# EAGLE design Ocreeb 12 (EAGLE 9.6.2)
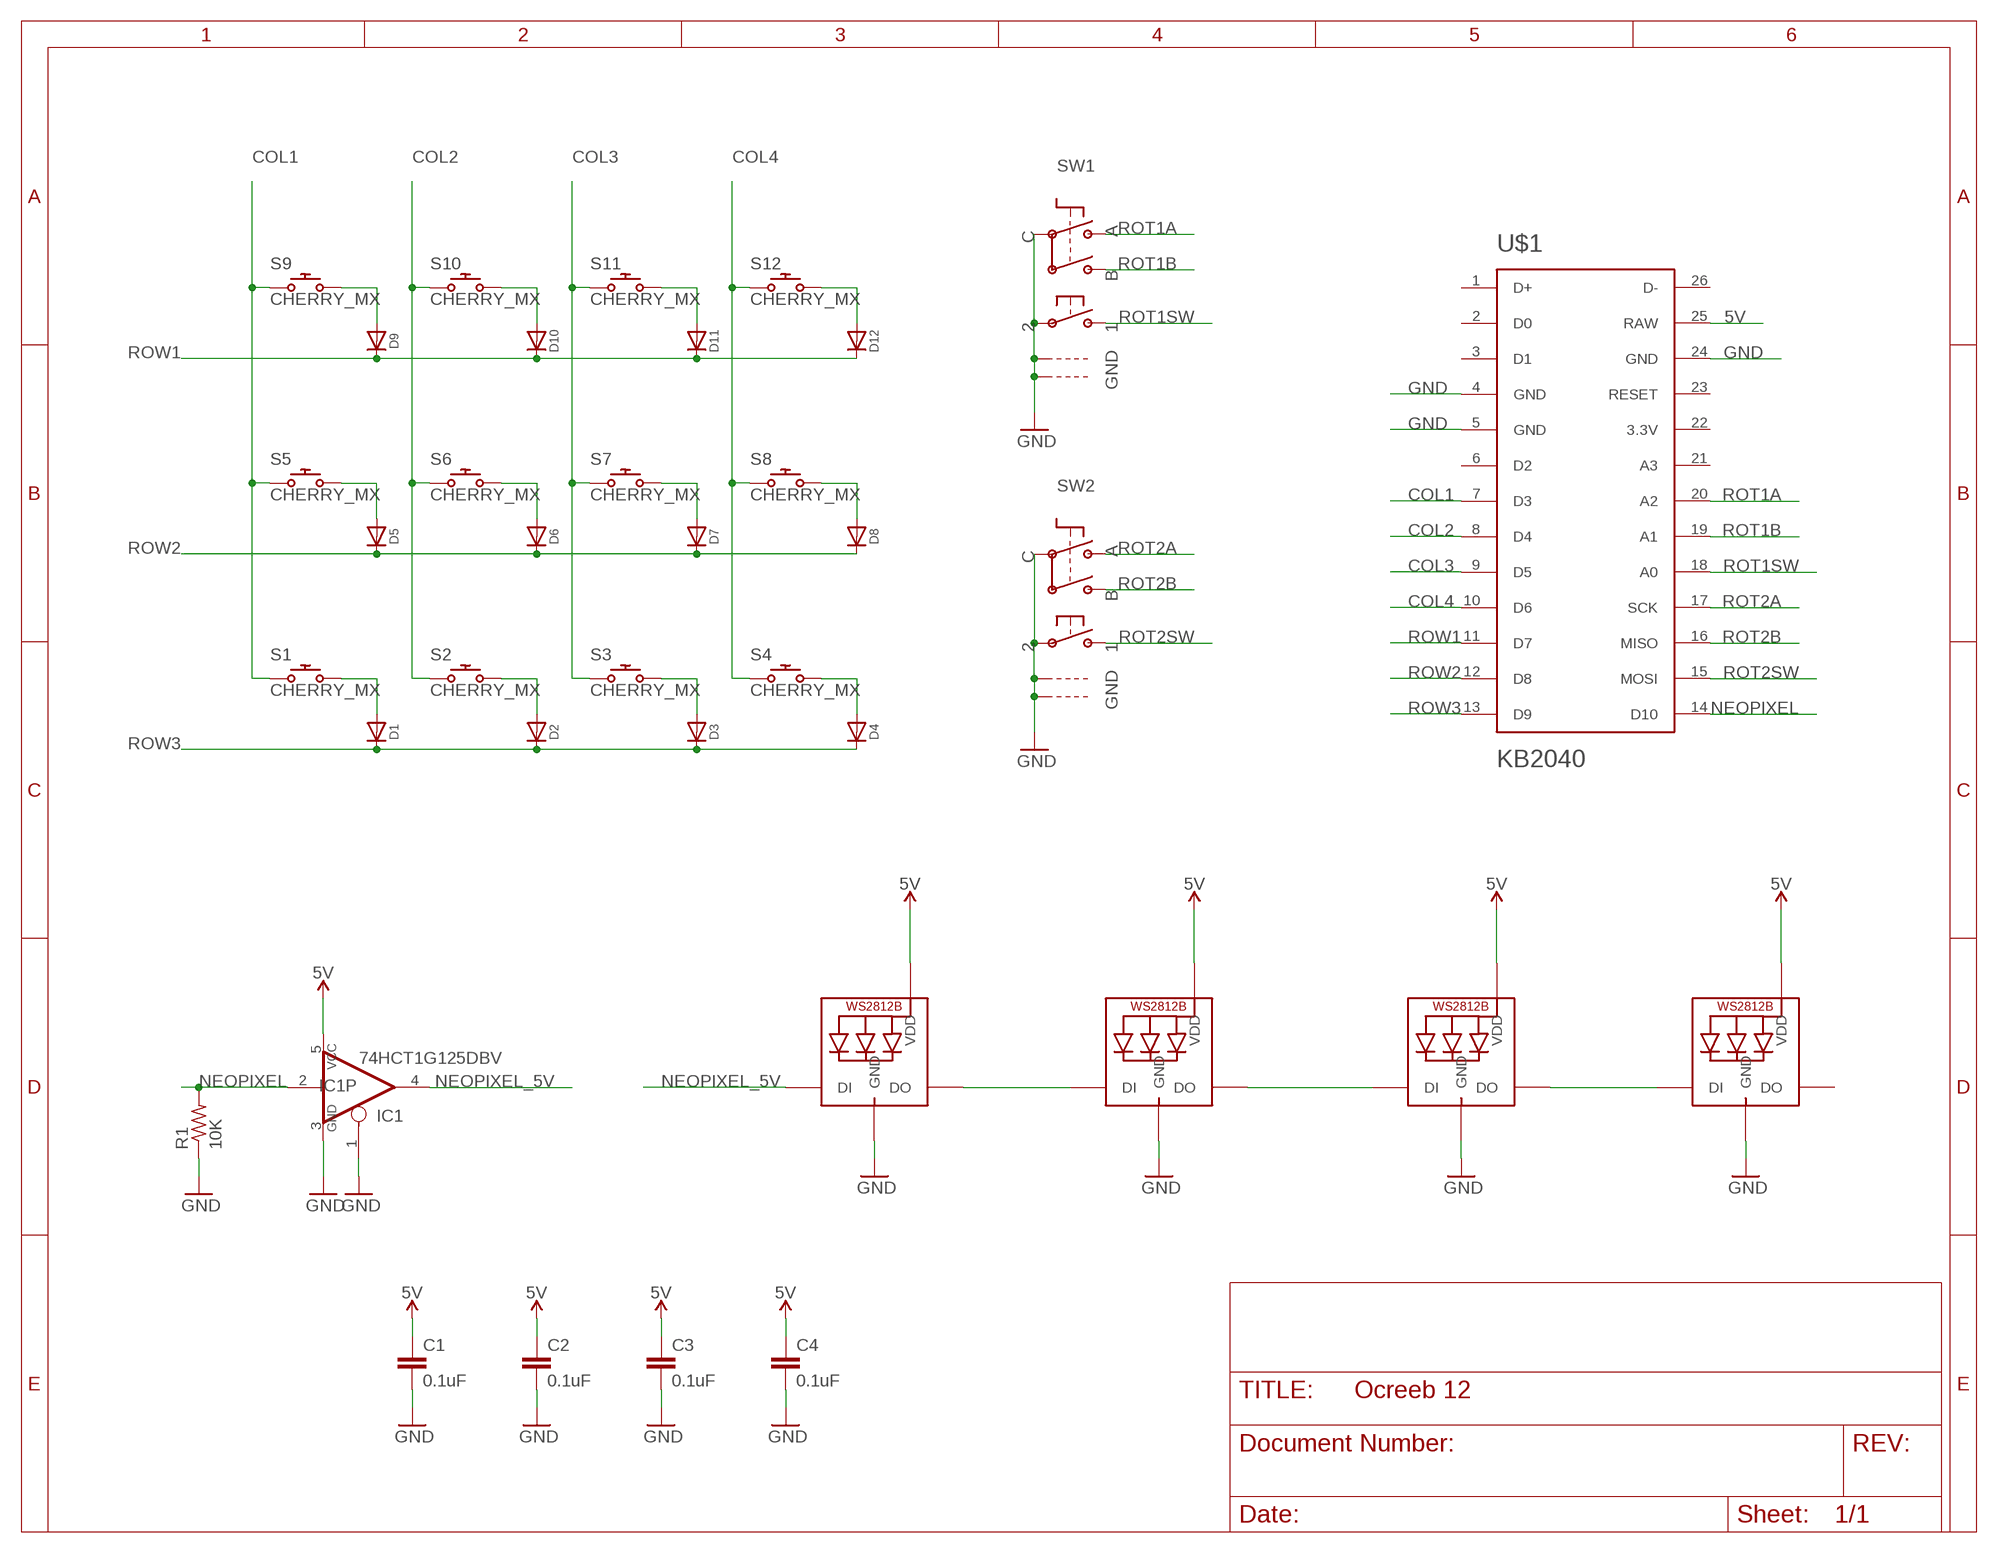
[diagram p0: schematic, sheet 1]

## Parts
C1  0.1uF  0.1UF-0603-25V-(+80/-20%)  [0603]
C2  0.1uF  0.1UF-0603-25V-(+80/-20%)  [0603]
C3  0.1uF  0.1UF-0603-25V-(+80/-20%)  [0603]
C4  0.1uF  0.1UF-0603-25V-(+80/-20%)  [0603]
D1  MICROBUILDER_DIODESOD-123  [MICROBUILDER_SOD-123]
D2  MICROBUILDER_DIODESOD-123  [MICROBUILDER_SOD-123]
D3  MICROBUILDER_DIODESOD-123  [MICROBUILDER_SOD-123]
D4  MICROBUILDER_DIODESOD-123  [MICROBUILDER_SOD-123]
D5  MICROBUILDER_DIODESOD-123  [MICROBUILDER_SOD-123]
D6  MICROBUILDER_DIODESOD-123  [MICROBUILDER_SOD-123]
D7  MICROBUILDER_DIODESOD-123  [MICROBUILDER_SOD-123]
D8  MICROBUILDER_DIODESOD-123  [MICROBUILDER_SOD-123]
D9  MICROBUILDER_DIODESOD-123  [MICROBUILDER_SOD-123]
D10  MICROBUILDER_DIODESOD-123  [MICROBUILDER_SOD-123]
D11  MICROBUILDER_DIODESOD-123  [MICROBUILDER_SOD-123]
D12  MICROBUILDER_DIODESOD-123  [MICROBUILDER_SOD-123]
IC1  74HCT1G125DBV  74AHC1G125DBV  [SOT23-5]
LED1  WS2812B5050  [WS2812B]
LED2  WS2812B5050  [WS2812B]
LED3  WS2812B5050  [WS2812B]
LED4  WS2812B5050  [WS2812B]
R1  10K  R-US_R0805  [R0805]
S1  CHERRY_MX  [CHERRY_MX]
S2  CHERRY_MX  [CHERRY_MX]
S3  CHERRY_MX  [CHERRY_MX]
S4  CHERRY_MX  [CHERRY_MX]
S5  CHERRY_MX  [CHERRY_MX]
S6  CHERRY_MX  [CHERRY_MX]
S7  CHERRY_MX  [CHERRY_MX]
S8  CHERRY_MX  [CHERRY_MX]
S9  CHERRY_MX  [CHERRY_MX]
S10  CHERRY_MX  [CHERRY_MX]
S11  CHERRY_MX  [CHERRY_MX]
S12  CHERRY_MX  [CHERRY_MX]
SW1  ADAFRUIT_ELECTROMECH_ENCODER_PLUS_SWITCH_BOURNS_PEC11  [ADAFRUIT_ELECTROMECH_PEC11+SWITCH]
SW2  ADAFRUIT_ELECTROMECH_ENCODER_PLUS_SWITCH_BOURNS_PEC11  [ADAFRUIT_ELECTROMECH_PEC11+SWITCH]
U$1  KB2040  [KB2040_SMD]

## Nets
5V [5V]: C1.1 C2.1 C3.1 C4.1 IC1.5(VCC) LED1.1-VDD(VDD) LED2.1-VDD(VDD) LED3.1-VDD(VDD) LED4.1-VDD(VDD) U$1.25(RAW)
COL1: S1.S1 S5.S1 S9.S1 U$1.7(D3)
COL2: S2.S1 S6.S1 S10.S1 U$1.8(D4)
COL3: S3.S1 S7.S1 S11.S1 U$1.9(D5)
COL4: S4.S1 S8.S1 S12.S1 U$1.10(D6)
GND: C1.2 C2.2 C3.2 C4.2 IC1.1(OE) IC1.3(GND) LED1.3-GND(GND) LED2.3-GND(GND) LED3.3-GND(GND) LED4.3-GND(GND) R1.1 SW1.P$2 SW1.P$C SW1.P$GND1 SW1.P$GND2 SW2.P$2 SW2.P$C SW2.P$GND1 SW2.P$GND2 U$1.4(GND) U$1.5(GND) U$1.24(GND)
N$1: LED1.2-DOUT(DO) LED2.4-DIN(DI)
N$2: LED2.2-DOUT(DO) LED3.4-DIN(DI)
N$3: LED3.2-DOUT(DO) LED4.4-DIN(DI)
N$5: D5.A S5.S2
N$14: D6.A S6.S2
N$15: D8.A S8.S2
N$16: D7.A S7.S2
N$18: D2.A S2.S2
N$19: D3.A S3.S2
N$20: D1.A S1.S2
N$21: D4.A S4.S2
N$22: D10.A S10.S2
N$23: D12.A S12.S2
N$24: D11.A S11.S2
N$25: D9.A S9.S2
NEOPIXEL: IC1.2(I) R1.2 U$1.14(D10)
NEOPIXEL_5V: IC1.4(O) LED1.4-DIN(DI)
ROT1A: SW1.P$A U$1.20(A2)
ROT1B: SW1.P$B U$1.19(A1)
ROT1SW: SW1.P$1 U$1.18(A0)
ROT2A: SW2.P$A U$1.17(SCK)
ROT2B: SW2.P$B U$1.16(MISO)
ROT2SW: SW2.P$1 U$1.15(MOSI)
ROW1: D9.C D10.C D11.C D12.C U$1.11(D7)
ROW2: D5.C D6.C D7.C D8.C U$1.12(D8)
ROW3: D1.C D2.C D3.C D4.C U$1.13(D9)
Unconnected: LED4.2-DOUT(DO) U$1.1(D+) U$1.2(D0) U$1.3(D1) U$1.6(D2) U$1.21(A3) U$1.22(3.3V) U$1.23(RESET) U$1.26(D-)

## Library data of the parts
C1-C4 = SparkFun-Capacitors:0.1UF: 0.1µF ceramic capacitors A capacitor is a passive two-terminal electrical component used to store electrical energy temporarily in an electric field.; PROD_ID: CAP-00810
D1-D12 = Adafruit MacroPad 2040:MICROBUILDER_DIODE: Diode SMA Model Volts Amps Type Vf Ir Digikey # Notes SSA34-E3 40V 3A Schottky 480mV @ 3A 200uA @ 40V SSA34-E3/61TGITR-ND CDBA120-G 20V 1A Schottky 500mV @ 1A 500uA @ 20V 641-1014-6-ND REEL MBRA210 10V 2A Schottky 350mV @ 2A 700uA @ 10V MBRA210LT3 SOD-123 Model Volts Amps Type Vf Ir Order # Notes BAT54T1G 30V 200mA Schottky 800mV @ 200mA 2uA @ 25V BAT54T1GOSTR-ND B0530W 30V 500mA Schottky 430mV @ 500mA 130uA @ 30V B0530W-FDICT-ND REEL MBR120 20V 1A Schottky 340mV @ 1A MBR120VLSFT1GOSCT-ND SOD-323 Model Volts Amps Type Vf Ir Order # Notes PMEG2005EJ 20V 500mA Schottky 355mV @ 500mA 568-4110-1-ND ZLLS410 10V 570mA Schottky 380mV @ 570mA ZLLS410CT-ND 1N4148WS 75V 150mA Silicon/Simple 1V 1N4148WSFSCT-ND REEL SOD-523 Model Volts Amps Type Vf Ir Order # Notes BAT54XV2 30V 200mA Schottky 0.8V @ 100mA BAT54XV2CT-ND TB751S 30V 30mA Schottky RB751S-40TE61CT-ND SOT23-R/W (R = Solder Paste/Reflow Ovens, W = Hand-Soldering) Model Volts Amps Type Vf Ir Order # Notes BAT54FILM 40V 300mA Schottky 497-7162-1-ND POWERDI-5 Model Volts Amps Type Vf Ir Order # Notes PDS560 60V 5A Schottky 670mV @ 5A 150uA @ 60V PDS560DICT-ND
IC1 = 74xx-little-us:74*1G125: Single Bus Buffer Gate with 3-State Output
LED1-LED4 = adafruit:WS2812B
R1 = adafruit:R-US_: RESISTOR, American symbol
S1-S12 = cherry:CHERRY_MX: Cherry keymodule MX; FARNELL: 2292961; MOUSER: 540-MX1A-11NW
SW1 SW2 = Adafruit MacroPad 2040:ADAFRUIT_ELECTROMECH_ENCODER_PLUS_SWITCH: Rotary Encoder with Built-In Switch PEC11 - 24 Step, PEC11-4215F-S24 - http://www.adafruit.com/products/377
U$1 = Adafruit KB2040:KB2040

## Net classes
0 default: width 0.178 mm
2 5V: width 0.406 mm, drill 0.483 mm

## Board
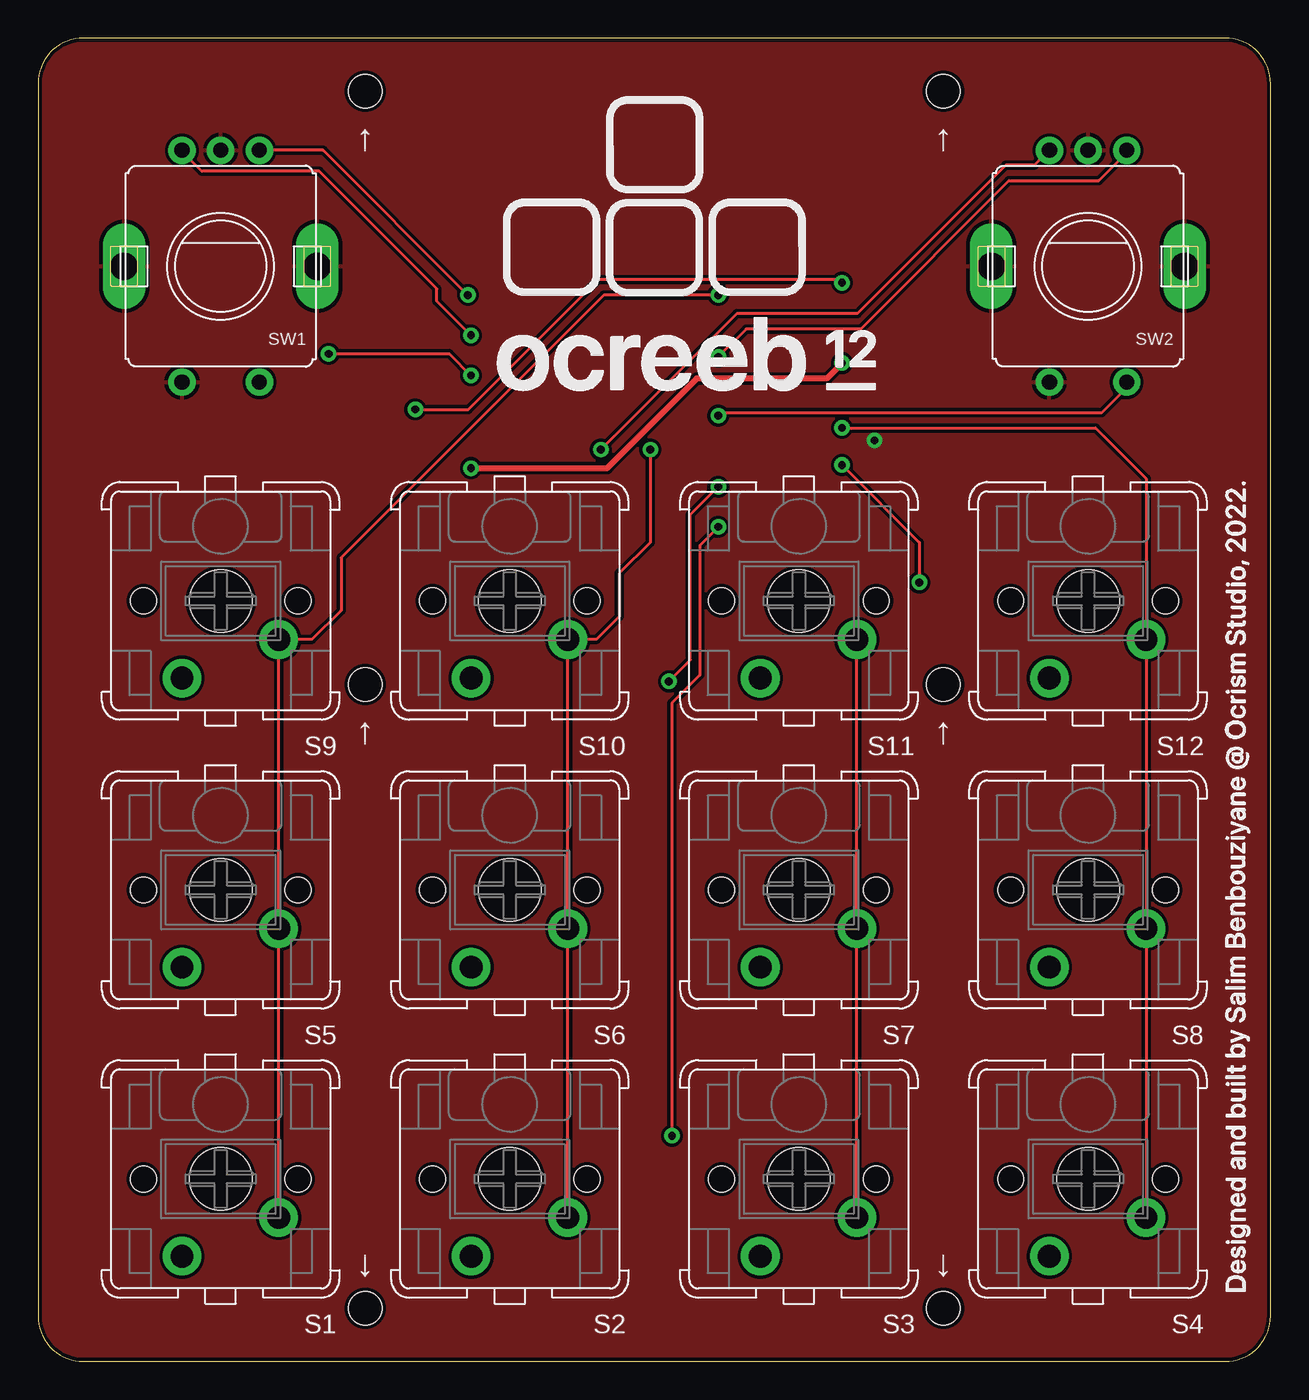
[diagram p1: board, top side]
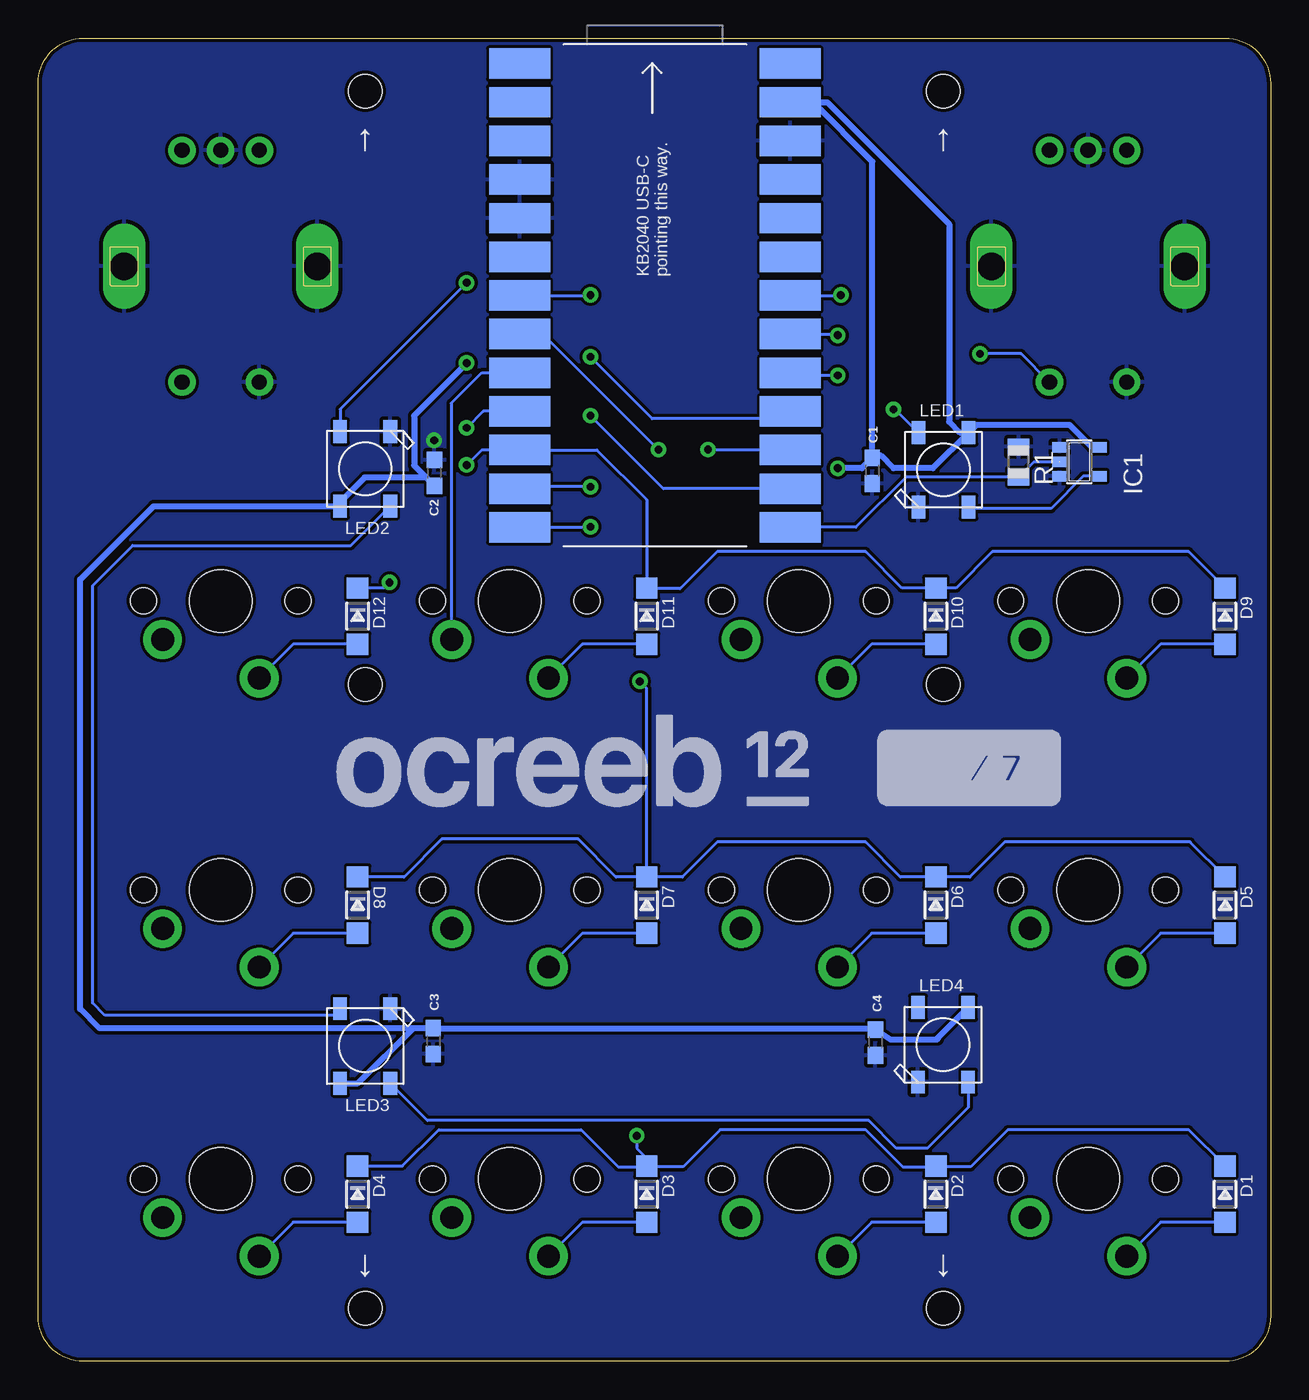
[diagram p2: board, bottom side, seen from below]

Size 81 x 87 mm. Coordinates in mm from the lower left corner, seen from the top.
Outline: 0,84 0,3 arc90 3,0 78,0 arc90 81,3 81,84 arc90 78,87 3,87 arc90 0,84
Copper layers (1*16): Top 0.035mm / dielectric 1.5mm / Bottom 0.035mm
Design rules "SparkFun": minimum track width 8mil, minimum drill 20mil, track to track 8mil, track to pad 8mil, pad to pad 8mil, via to via 8mil, smd to smd 8mil, copper to edge 10mil, drill to drill 8mil, minimum pad ring 12mil, minimum via ring 10mil, stop-mask expansion 4mil, vias tented up to drill 25mil, thermal gap 10mil
Holes 2.2 mm at 21.5,3.5 59.5,3.5 59.5,44.5 21.5,44.5 21.5,83.5 59.5,83.5

### Footprints (pad centres in the part's own frame; a part is rotated, then mirrored left to right if it is on the bottom)
0603 = smd 1.1 x 1: 1 -0.85,0; 2 0.85,0
MICROBUILDER_SOD-123 = smd 1.4 x 1.4: A 1.85,0; C -1.85,0
SOT23-5 = smd 0.69 x 0.99: 1 -0.95,-1.29; 2 0,-1.29; 3 0.95,-1.29; 4 0.95,1.3; 5 -0.95,1.3
WS2812B = smd 1.5 x 0.9: 1-VDD 2.45,-1.65; 2-DOUT 2.45,1.65; 3-GND -2.45,1.65; 4-DIN -2.45,-1.65
R0805 = smd 1.1 x 1.4: 1 -1,0; 2 1,0
CHERRY_MX = drill 1.5 pad 2.54: S1 -3.81,2.54; S2 2.54,5.08 | hole 1.7: -5.08,0; 5.08,0 | hole 4.1: 0,0
ADAFRUIT_ELECTROMECH_PEC11+SWITCH = drill 1 pad 1.8: P$1 -2.54,7.62; P$2 2.54,7.62; P$A -2.54,-7.62; P$B 2.54,-7.62; P$C 0,-7.62 | drill 1.8 pad 2.8 long: P$GND1 -6.35,0; P$GND2 6.35,0
KB2040_SMD = smd 2 x 4: 1 -15.24,-8.89; 2 -12.7,-8.89; 3 -10.16,-8.89; 4 -7.62,-8.89; 5 -5.08,-8.89; 6 -2.54,-8.89; 7 0,-8.89; 8 2.54,-8.89; 9 5.08,-8.89; 10 7.62,-8.89; 11 10.16,-8.89; 12 12.7,-8.89; 13 15.24,-8.89; 14 15.24,8.89; 15 12.7,8.89; 16 10.16,8.89; 17 7.62,8.89; 18 5.08,8.89; 19 2.54,8.89; 20 0,8.89; 21 -2.54,8.89; 22 -5.08,8.89; 23 -7.62,8.89; 24 -10.16,8.89; 25 -12.7,8.89; 26 -15.24,8.89

### Placement (x,y rotation side)
C1  26.18,58.56 270 bottom
C2  54.95,58.42 90 bottom
C3  55.02,21.06 270 bottom
C4  25.97,20.97 270 bottom
D1  3,11 270 bottom
D2  22,11 270 bottom
D3  41,11 270 bottom
D4  60,11 270 bottom
D5  3,30 270 bottom
D6  22,30 270 bottom
D7  41,30 270 bottom
D8  60,30 270 bottom
D9  3,49 270 bottom
D10  22,49 270 bottom
D11  41,49 270 bottom
D12  60,49 270 bottom
IC1  12.58,59.14 270 bottom
LED1  21.5,58.62 90 bottom
LED2  59.5,58.68 270 bottom
LED3  59.5,20.74 270 bottom
LED4  21.53,20.82 90 bottom
R1  16.57,59.13 270 bottom
S1  12,12 180 top
S2  31,12 180 top
S3  50,12 180 top
S4  69,12 180 top
S5  12,31 180 top
S6  31,31 180 top
S7  50,31 180 top
S8  69,31 180 top
S9  12,50 180 top
S10  31,50 180 top
S11  50,50 180 top
S12  69,50 180 top
SW1  12,72 180 top
SW2  69,72 180 top
U$1  40.46,70.08 270 bottom

### Tracks (layer width: path | path; a pad name or v marks a point on that pad's centre or on a via)
5V  (via drill 0.51)
  Top 0.406: v28.45,58.73 37.39,58.73 43.28,64.62 51.82,64.62 v52.83,65.63
  Bottom 0.406: IC1.5 11.73,60.09 13.21,61.57 19.35,61.57 LED1.1-VDD | U$1.25 30.07,82.78 | 30.07,82.78 29.14,82.78 21.13,74.78 21.13,61.77 20.43,61.07 LED1.1-VDD | LED1.1-VDD 22.2,58.73 24.79,58.73 25.6,59.54 26.05,59.54 C1.1 | C2.1 55.49,58.12 | 55.49,58.12 59.54,58.12 61.15,56.5 LED2.1-VDD 73.41,56.23 78.23,51.41 78.23,23.16 76.98,21.91 C3.1 | C1.1 26.18,78.89 30.07,82.78 | C1.1 26.86,58.73 v28.45,58.73 | v52.83,65.63 56.29,62.18 56.29,58.91 55.49,58.12 | C3.1 26.06,21.91 C4.1 25.03,21.18 21.88,21.18 21.88,21.27 LED4.1-VDD | C3.1 56.36,21.91 59.98,18.29 LED3.1-VDD
COL1  (via drill 0.51)
  Top 0.203: S1.S1 S5.S1 S9.S1 18,47.46 19.91,49.38 19.91,52.83 37.19,70.1 v44.7,70.1
  Bottom 0.203: U$1.7 44.73,70.08 v44.7,70.1
COL2  (via drill 0.51)
  Top 0.203: S2.S1 S6.S1 S10.S1 36.69,47.46 38.2,48.97 38.2,51.82 40.23,53.85 v40.23,59.94
  Bottom 0.203: U$1.8 47.83,67.54 v40.23,59.94
COL3
  Top 0.203: S3.S1 S7.S1 S11.S1
  Bottom 0.203: S11.S1 53.85,47.5 53.85,62.99 51.84,65 U$1.9
COL4  (via drill 0.51)
  Top 0.203: v52.83,61.37 69.49,61.37 72.81,58.05 S12.S1 S8.S1 S4.S1
  Bottom 0.203: U$1.10 51.74,62.46 v52.83,61.37
GND  (via drill 0.51)
  other vias: 54.97,60.55
  pour Top: 0,0 81,0 81,87 0,87
  pour Bottom: 0,0 81,0 81,87 0,87
N$1  (via drill 0.51)
  Top 0.203: v24.79,62.59 28.28,62.59 36.81,71.12 52.63,71.12 v52.83,70.92
  Bottom 0.203: LED1.2-DOUT 24.67,62.59 v24.79,62.59 | v52.83,70.92 61.15,62.6 LED2.4-DIN
N$2
  Bottom 0.203: LED3.4-DIN 61.58,22.76 76.61,22.76 77.42,23.57 77.42,51 74.78,53.65 60.44,53.65 LED2.2-DOUT
N$3
  Bottom 0.203: LED4.4-DIN 19.88,16.7 22.55,14.02 24.59,14.02 26.42,15.85 55.41,15.85 LED3.2-DOUT
N$5
  Bottom 0.203: D5.A 7.23,28.15 S5.S2
N$14
  Bottom 0.203: D6.A 26.23,28.15 S6.S2
N$15
  Bottom 0.203: D8.A 64.23,28.15 S8.S2
N$16
  Bottom 0.203: D7.A 45.23,28.15 S7.S2
N$18
  Bottom 0.203: D2.A 26.23,9.15 S2.S2
N$19
  Bottom 0.203: D3.A 45.23,9.15 S3.S2
N$20
  Bottom 0.203: D1.A 7.23,9.15 S1.S2
N$21
  Bottom 0.203: D4.A 64.23,9.15 S4.S2
N$22
  Bottom 0.203: D10.A 26.23,47.15 S10.S2
N$23
  Bottom 0.203: D12.A 64.23,47.15 S12.S2
N$24
  Bottom 0.203: D11.A 45.23,47.15 S11.S2
N$25
  Bottom 0.203: D9.A 7.23,47.15 S9.S2
NEOPIXEL
  Bottom 0.203: IC1.2 15.56,59.14 R1.2 23.96,58.13 27.25,54.84 U$1.14
NEOPIXEL_5V
  Bottom 0.203: IC1.4 12.32,58.19 14.43,56.08 19.76,56.08 LED1.4-DIN
ROT1A  (via drill 0.51)
  Top 0.203: v28.25,70.1 18.73,79.62 SW1.P$A
  Bottom 0.203: U$1.20 28.27,70.08 v28.25,70.1
ROT1B  (via drill 0.51)
  Top 0.203: v28.45,67.46 26.21,69.7 26.21,70.51 18.49,78.23 10.77,78.23 9.46,79.54 SW1.P$B
  Bottom 0.203: U$1.19 28.53,67.54 v28.45,67.46
ROT1SW  (via drill 0.51)
  Top 0.203: v19.1,66.24 27.03,66.24 v28.45,64.82
  Bottom 0.203: SW1.P$1 16.4,66.24 v19.1,66.24 | v28.45,64.82 31.39,64.82 U$1.18
ROT2A  (via drill 0.51)
  Top 0.203: v44.7,66.04 46.53,67.87 54.05,67.87 63.8,77.62 69.7,77.62 71.54,79.47 SW2.P$A
  Bottom 0.203: U$1.17 32.05,61.98 40.64,61.98 v44.7,66.04
ROT2B  (via drill 0.51)
  Top 0.203: SW2.P$B 65.48,78.64 63.6,78.64 53.85,68.89 45.92,68.89 v36.98,59.94
  Bottom 0.203: U$1.16 31.59,59.94 v36.98,59.94
ROT2SW  (via drill 0.51)
  Top 0.203: v44.7,62.18 44.91,62.38 69.9,62.38 71.54,64.02 SW2.P$1
  Bottom 0.203: U$1.15 39.91,57.38 v44.7,62.18
ROW1  (via drill 0.51)
  Top 0.203: v52.83,58.93 57.91,53.85 v57.91,51.21
  Bottom 0.203: D9.C 5.39,53.24 18.29,53.24 20.68,50.85 D10.C 24.23,50.85 26.62,53.24 36.37,53.24 38.81,50.8 40.95,50.8 D11.C 41,56.65 44.27,59.92 U$1.11 51.84,59.92 v52.83,58.93 | v57.91,51.21 58.27,50.85 D12.C
ROW2  (via drill 0.51)
  Top 0.203: v41.45,44.7 42.88,46.13 42.88,55.68 v44.7,57.51
  Bottom 0.203: D5.C 5.28,34.13 5.28,34.14 17.48,34.14 19.76,31.85 D6.C 24.33,31.85 26.62,34.14 36.37,34.14 38.66,31.85 D7.C | D7.C 43.03,31.85 45.52,34.34 54.46,34.34 56.95,31.85 D8.C | D7.C 41,44.25 v41.45,44.7 | v44.7,57.51 49.22,57.51 U$1.12
ROW3  (via drill 0.51)
  Top 0.203: v44.7,54.86 43.48,53.65 43.48,45.11 41.66,43.28 v41.66,14.83
  Bottom 0.203: D1.C 5.39,15.24 17.27,15.24 19.71,12.8 21.95,12.8 D2.C 22.05,12.8 24.18,12.8 26.62,15.24 36.17,15.24 38.61,12.8 40.95,12.8 | 40.95,12.8 D3.C | D4.C 57.05,12.85 54.66,15.24 45.31,15.24 42.88,12.8 40.95,12.8 | U$1.13 44.73,54.84 v44.7,54.86 | v41.66,14.83 41.66,14.02 40.95,13.32 40.95,12.8

### Text on the board
tPlace: ↑ | ↑ | ↑ | ↑ | ↓ | ↓
bPlace: ↑ | ↑ | KB2040 USB-C / pointing this way. | ↓ | ↓